# Altium schematic sheet GSM_Link_12_SIM900A.SchDoc
size A
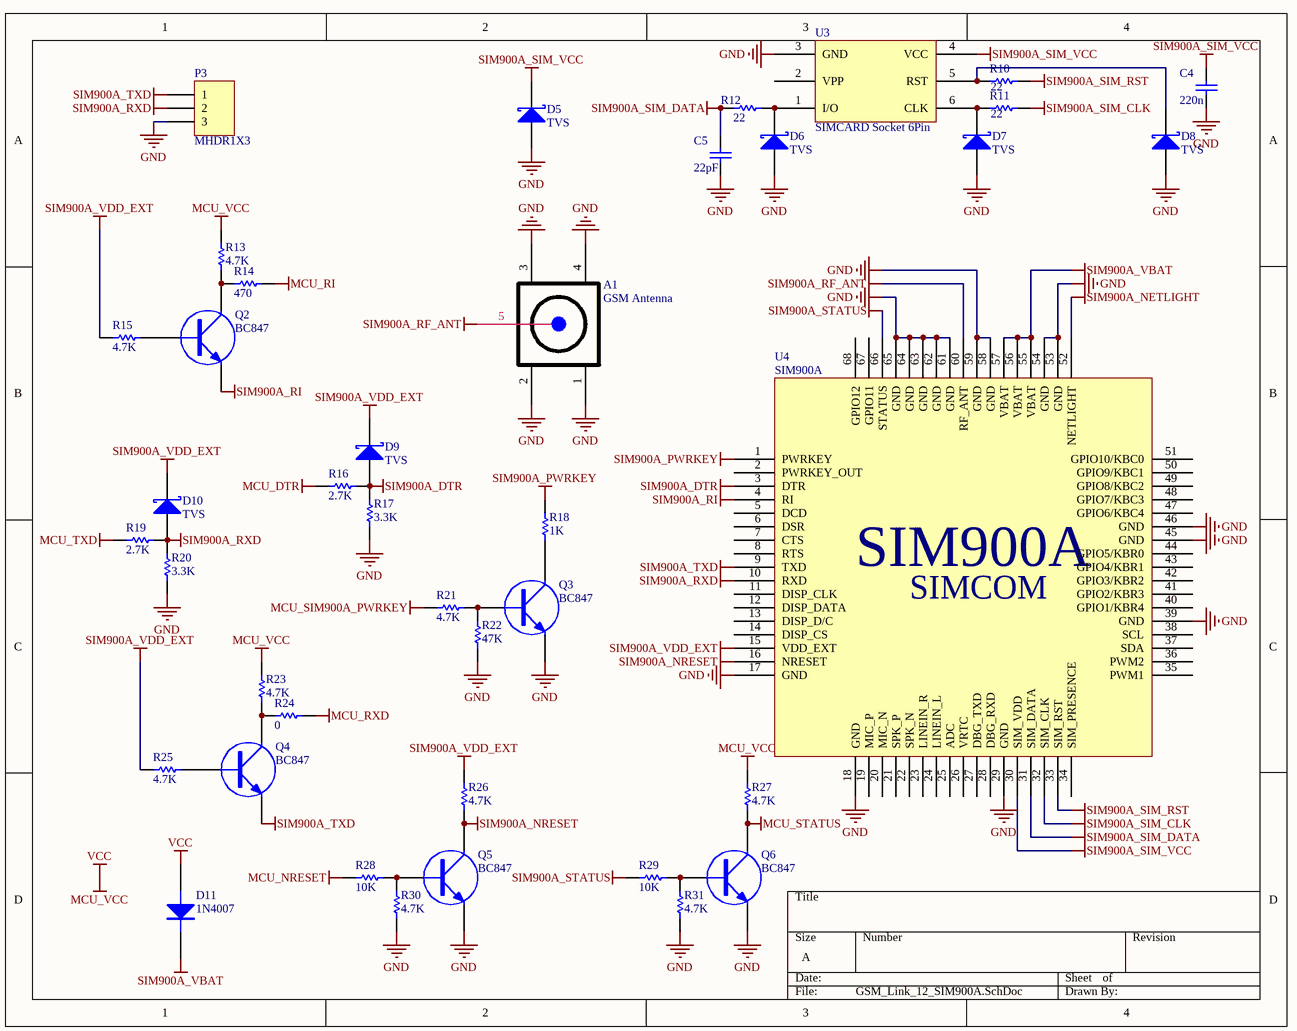
[diagram p0: GSM_Link_12_SIM900A.SchDoc]

## Parts
A1  GSM Antenna  [SMA Right Female]
C4  220n  [0805_smd]
C5  22pF  [0805_smd]
D5  TVS  [7227_SMD]
D6  TVS  [7227_SMD]
D7  TVS  [7227_SMD]
D8  TVS  [7227_SMD]
D9  TVS  [7227_SMD]
D10  TVS  [7227_SMD]
D11  1N4007  [7227_SMD]
P3  MHDR1X3  [CON3_XH]
Q2  BC847  [SOT23_SMD]
Q3  BC847  [SOT23_SMD]
Q4  BC847  [SOT23_SMD]
Q5  BC847  [SOT23_SMD]
Q6  BC847  [SOT23_SMD]
R10  22  [0805_SMD]
R11  22  [0805_SMD]
R12  22  [1206_SMD]
R13  4.7K  [0805_SMD]
R14  470  [1206_SMD]
R15  4.7K  [0805_SMD]
R16  2.7K  [1206_SMD]
R17  3.3K  [0805_SMD]
R18  1K  [0805_SMD]
R19  2.7K  [1206_SMD]
R20  3.3K  [1206_SMD]
R21  4.7K  [0805_SMD]
R22  47K  [0805_SMD]
R23  4.7K  [1206_SMD]
R24  0  [1206_SMD]
R25  4.7K  [0805_SMD]
R26  4.7K  [0805_SMD]
R27  4.7K  [0805_SMD]
R28  10K  [1206_SMD]
R29  10K  [0805_SMD]
R30  4.7K  [0805_SMD]
R31  4.7K  [0805_SMD]
U3  SIMCARD Socket 6Pin  [SIMCARD Socket - Ejector]
U4  SIM900A  [SIM900A]

## Nets
GND: A1.1 A1.2 A1.3 A1.4 C4.1 C5.1 D5.A D6.A D7.A D8.A P3.3 Q3.2(E) Q5.2(E) Q6.2(E) R17.1 R20.1 R22.2 R30.1 R31.1 U3.3(GND) U4.17(GND) U4.18(GND) U4.29(GND) U4.39(GND) U4.45(GND) U4.46(GND) U4.53(GND) U4.54(GND) U4.58(GND) U4.59(GND) U4.61(GND) U4.62(GND) U4.63(GND) U4.64(GND) U4.65(GND)
MCU_DTR: R16.2
MCU_NRESET: R28.1
MCU_RI: R14.2
MCU_RXD: R24.2
MCU_SIM900A_PWRKEY: R21.1
MCU_STATUS: Q6.3(C) R27.2
MCU_TXD: R19.2
MCU_VCC: D11.A R13.2 R23.2 R27.1  [also labelled VCC]
SIM900A_DTR: D9.A R16.1 R17.2 U4.3(DTR)
SIM900A_NETLIGHT: U4.52(NETLIGHT)
SIM900A_NRESET: Q5.3(C) R26.1 U4.16(NRESET)
SIM900A_PWRKEY: R18.2 U4.1(PWRKEY)
SIM900A_RF_ANT: A1.5 U4.60(RF_ANT)
SIM900A_RI: Q2.2(E) U4.4(RI)
SIM900A_RXD: D10.A P3.2 R19.1 R20.2 U4.10(RXD)
SIM900A_SIM_CLK: R11.2 U4.32(SIM_CLK)
SIM900A_SIM_DATA: C5.2 R12.2 U4.31(SIM_DATA)
SIM900A_SIM_RST: R10.2 U4.33(SIM_RST)
SIM900A_SIM_VCC: C4.2 D5.K U3.4(VCC) U4.30(SIM_VDD)
SIM900A_STATUS: R29.2 U4.66(STATUS)
SIM900A_TXD: P3.1 Q4.2(E) U4.9(TXD)
SIM900A_VBAT: D11.K U4.55(VBAT) U4.56(VBAT) U4.57(VBAT)
SIM900A_VDD_EXT: D9.K D10.K R15.1 R25.1 R26.2 U4.15(VDD_EXT)
NetD6_K: D6.K R12.1 U3.1(I/O)
NetD7_K: D7.K R11.1 U3.6(CLK)
NetD8_K: D8.K R10.1 U3.5(RST)
NetQ2_1: Q2.1(B) R15.2
NetQ2_3: Q2.3(C) R13.1 R14.1
NetQ3_1: Q3.1(B) R21.2 R22.1
NetQ3_3: Q3.3(C) R18.1
NetQ4_1: Q4.1(B) R25.2
NetQ4_3: Q4.3(C) R23.1 R24.1
NetQ5_1: Q5.1(B) R28.2 R30.2
NetQ6_1: Q6.1(B) R29.1 R31.2

Not connected (* = marked no-connect by the designer): U3 2(VPP); U4 2(PWRKEY_OUT) 5(DCD) 6(DSR) 7(CTS) 8(RTS) 11(DISP_CLK) 12(DISP_DATA) 13(DISP_D/C) 14(DISP_CS) 19(MIC_P) 20(MIC_N) 21(SPK_P) 22(SPK_N) 23(LINEIN_R) 24(LINEIN_L) 25(ADC) 26(VRTC) 27(DBG_TXD) 28(DBG_RXD) 34(SIM_PRESENCE) 35(PWM1) 36(PWM2) 37(SDA) 38(SCL) 40(GPIO1/KBR4) 41(GPIO2/KBR3) 42(GPIO3/KBR2) 43(GPIO4/KBR1) 44(GPIO5/KBR0) 47(GPIO6/KBC4) 48(GPIO7/KBC3) 49(GPIO8/KBC2) 50(GPIO9/KBC1) 51(GPIO10/KBC0) 67(GPIO11) 68(GPIO12)

## Notes on the sheet
- (in symbol SIM900A) SIMCOM

## Library data of the parts
A1 = SMA KWE-F
C4 C5 = Cap: Capacitor; Value: 100u; Published: 8-Jun-2000; LatestRevisionDate: 17-Jul-2002; LatestRevisionNote: Re-released for DXP Platform.; PackageReference: RAD-0.3; Publisher: Altium Limited
D5-D10 = D Schottky: Schottky Diode; Published: 8-Jun-2000; LatestRevisionDate: 17-Jul-2002; LatestRevisionNote: Re-released for DXP Platform.; PackageReference: SMB; Publisher: Altium Limited; Code_JEDEC: DO-214-AA
D11 = DIODE
P3 = MHDR1X3: Header, 3-Pin; LatestRevisionDate: 17-Jul-2002; LatestRevisionNote: Re-released for DXP Platform.; Publisher: Altium Limited
Q2-Q6 = BC547
R10-R23 R25-R31 = Res1: Resistor; Published: 8-Jun-2000; LatestRevisionDate: 17-Jul-2002; LatestRevisionNote: Re-released for DXP Platform.; PackageReference: AXIAL-0.3; Publisher: Altium Limited
  R10-R12: Value: 22
  R13 R15 R21 R23 R25-R27 R30 R31: Value: 4.7K
  R14: Value: 470
  R16 R19: Value: 2.7K
  R17 R20: Value: 3.3K
  R18: Value: 1K
  R22: Value: 47K
  R28 R29: Value: 10K
R24 = Res1: Resistor; Value: 0R; Published: 8-Jun-2000; LatestRevisionDate: 17-Jul-2002; LatestRevisionNote: Re-released for DXP Platform.; PackageReference: AXIAL-0.3; Publisher: Altium Limited
U3 = SIM_SOCKET_6PIN